# Altium schematic sheet FTDI_Chip.SchDoc
size A; SheetNumber: 2; SheetTotal: 4
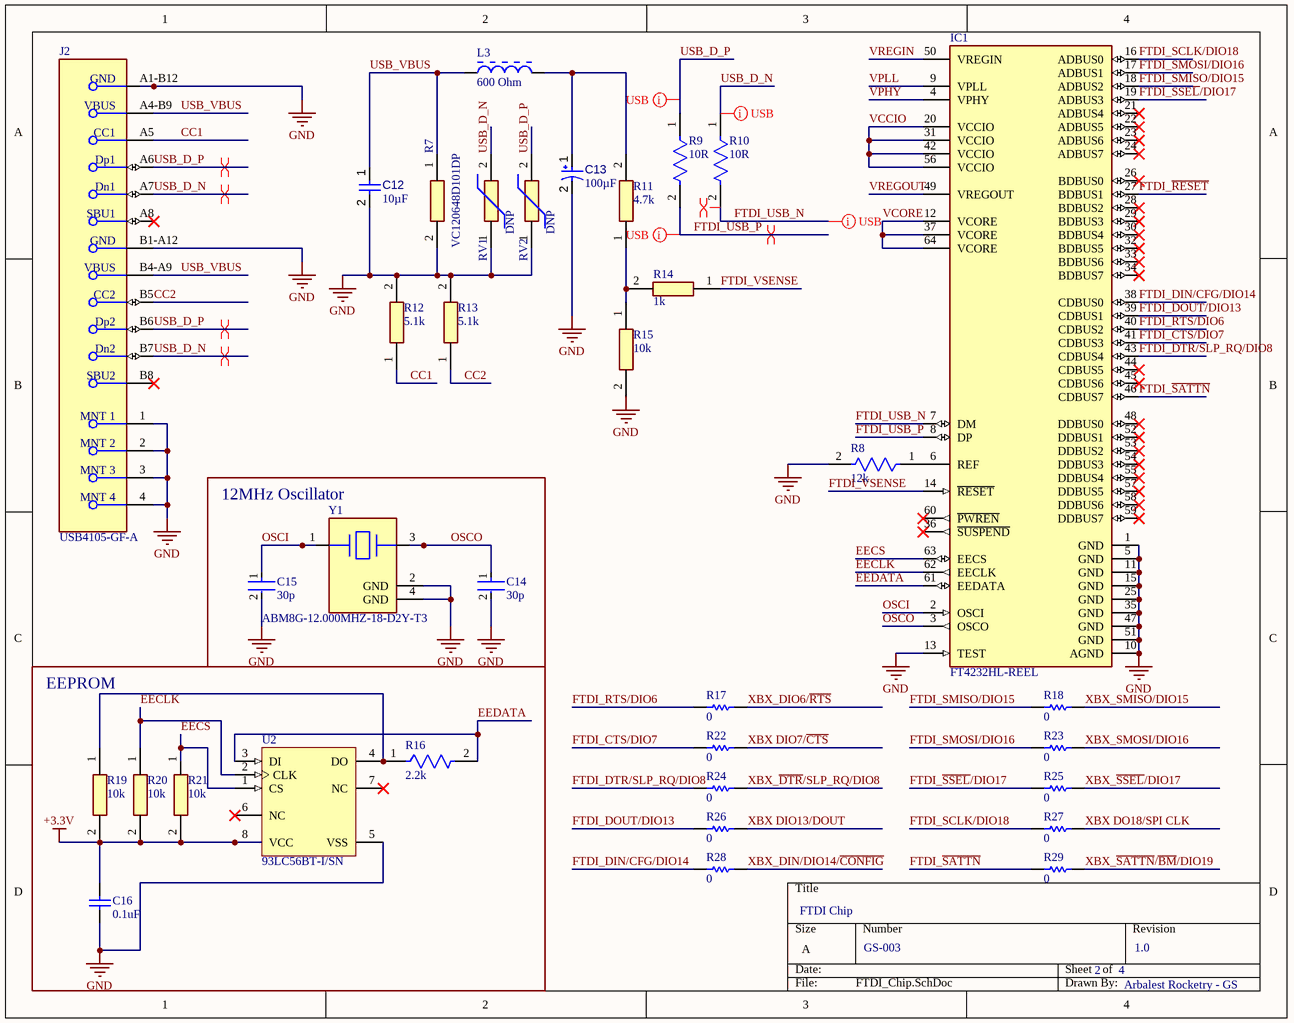
[diagram p0: FTDI_Chip.SchDoc]

## Parts
C12  value 10µF  [CAPC0805(2012)145_L]  (hidden comment: Capacitor 10µF +/-20% 25V 0805)
C13  value 100µF  [CAPPR65-350-1150X800X1250]  (hidden comment: ECA1HM101)
C14  30p  [FP-GCM188-0_1-IPC_B]
C15  30p  [FP-GCM188-0_1-IPC_B]
C16  0.1uF  [CAPC0603(1608)100_L]
IC1  FT4232HL-REEL  [FP-LQFP-64-MFG]
J2  USB4105-GF-A  [FP-USB4105-GF-A-MFG]
L3  600 Ohm  [LIRD-MI0805K601R-10-2_V]
R7  VC120648D101DP  [RESC3216X102N]
R8  12k  [FP-CRCW0402-e3-MFG]
R9  10R  [FP-CRCW0603-e3-MFG]
R10  10R  [FP-CRCW0603-e3-MFG]
R11  4.7k  [RESC1608X55N]
R12  5.1k  [RESC1608X55N]
R13  5.1k  [RESC1608X55N]
R14  1k  [RESC1608X55N]
R15  10k  [RESC1608X55N]
R16  2.2k  [FP-CRCW0603-Pe3-IPC_B]
R17  value 0  [RESC1608X55X25ML10T15]  (hidden comment: Resistor 0R +/- 5% 0603 100 mW)
R18  value 0  [RESC1608X55X25ML10T15]  (hidden comment: Resistor 0R +/- 5% 0603 100 mW)
R19  10k  [RESC1608X55N]
R20  10k  [RESC1608X55N]
R21  10k  [RESC1608X55N]
R22  value 0  [RESC1608X55X25ML10T15]  (hidden comment: Resistor 0R +/- 5% 0603 100 mW)
R23  value 0  [RESC1608X55X25ML10T15]  (hidden comment: Resistor 0R +/- 5% 0603 100 mW)
R24  value 0  [RESC1608X55X25ML10T15]  (hidden comment: Resistor 0R +/- 5% 0603 100 mW)
R25  value 0  [RESC1608X55X25ML10T15]  (hidden comment: Resistor 0R +/- 5% 0603 100 mW)
R26  value 0  [RESC1608X55X25ML10T15]  (hidden comment: Resistor 0R +/- 5% 0603 100 mW)
R27  value 0  [RESC1608X55X25ML10T15]  (hidden comment: Resistor 0R +/- 5% 0603 100 mW)
R28  value 0  [RESC1608X55X25ML10T15]  (hidden comment: Resistor 0R +/- 5% 0603 100 mW)
R29  value 0  [RESC1608X55X25ML10T15]  (hidden comment: Resistor 0R +/- 5% 0603 100 mW)
RV1  DNP  [VARC1608X90N]
RV2  DNP  [VARC1608X90N]
U2  93LC56BT-I/SN  [SOIC-SN8_N]
Y1  ABM8G-12.000MHZ-18-D2Y-T3  [FP-ABM8G-MFG]

## Blocks framed on the sheet
12MHz Oscillator: C14 C15 Y1
EEPROM: C16 R16 R19-R21 U2

## Nets
+3.3V: C16.2 R19.2 R20.2 R21.2 U2.8(VCC)
GND: C12.2 C13.2 C14.2 C15.2 C16.1 IC1.1(GND) IC1.5(GND) IC1.10(AGND) IC1.11(GND) IC1.13(TEST) IC1.15(GND) IC1.25(GND) IC1.35(GND) IC1.47(GND) IC1.51(GND) J2.1(MNT_1) J2.2(MNT_2) J2.3(MNT_3) J2.4(MNT_4) J2.A1-B12(GND) J2.B1-A12(GND) R7.2 R8.2 R12.2 R13.2 R15.2 RV1.1 RV2.1 U2.5(VSS) Y1.2(GND) Y1.4(GND)
CC1: J2.A5(CC1) R12.1
CC2: J2.B5(CC2) R13.1
EECLK: IC1.62(EECLK) R20.1 U2.2(CLK)
EECS: IC1.63(EECS) R21.1 U2.1(CS)
EEDATA: IC1.61(EEDATA) R16.2 U2.3(DI)
FTDI_CTS/DIO7: IC1.41(CDBUS3) R22.1
FTDI_DIN/CFG/DIO14: IC1.38(CDBUS0) R28.1
FTDI_DOUT/DIO13: IC1.39(CDBUS1) R26.1
FTDI_DTR/SLP_RQ/DIO8: IC1.43(CDBUS4) R24.1
FTDI_~{RESET}: IC1.27(BDBUS1)
FTDI_RTS/DIO6: IC1.40(CDBUS2) R17.1
FTDI_~{SATTN}: IC1.46(CDBUS7) R29.1
FTDI_~{SSEL}/DIO17: IC1.19(ADBUS3) R25.1
FTDI_SCLK/DIO18: IC1.16(ADBUS0) R27.1
FTDI_SMISO/DIO15: IC1.18(ADBUS2) R18.1
FTDI_SMOSI/DIO16: IC1.17(ADBUS1) R23.1
FTDI_USB_N: IC1.7(DM) R10.2
FTDI_USB_P: IC1.8(DP) R9.2
FTDI_VSENSE: IC1.14(~{RESET}) R14.1
OSCI: C15.1 IC1.2(OSCI) Y1.1
OSCO: C14.1 IC1.3(OSCO) Y1.3
USB_D_N: J2.A7(Dn1) J2.B7(Dn2) R10.1 RV1.2
USB_D_P: J2.A6(Dp1) J2.B6(Dp2) R9.1 RV2.2
USB_VBUS: C12.1 J2.A4-B9(VBUS) J2.B4-A9(VBUS) L3.1 R7.1
VCCIO: IC1.20(VCCIO) IC1.31(VCCIO) IC1.42(VCCIO) IC1.56(VCCIO)
VCORE: IC1.12(VCORE) IC1.37(VCORE) IC1.64(VCORE)
VPHY: IC1.4(VPHY)
VPLL: IC1.9(VPLL)
VREGIN: IC1.50(VREGIN)
VREGOUT: IC1.49(VREGOUT)
XBX DIO7/~{CTS}: R22.2
XBX DIO13/DOUT: R26.2
XBX DO18/SPI CLK: R27.2
XBX_~{DTR}/SLP_RQ/DIO8: R24.2
XBX_DIN/DIO14/~{CONFIG}: R28.2
XBX_DIO6/~{RTS}: R17.2
XBX_~{SATTN}/~{BM}/DIO19: R29.2
XBX_~{SSEL}/DIO17: R25.2
XBX_SMISO/DIO15: R18.2
XBX_SMOSI/DIO16: R23.2
NetC13_1: C13.1 L3.2 R11.2
NetIC1_6: IC1.6(REF) R8.1
NetR11_1: R11.1 R14.2 R15.1
NetR16_1: R16.1 R19.1 U2.4(DO)

Not connected (* = marked no-connect by the designer): IC1 21(ADBUS4)* 22(ADBUS5)* 23(ADBUS6)* 24(ADBUS7)* 26(BDBUS0)* 28(BDBUS2)* 29(BDBUS3)* 30(BDBUS4)* 32(BDBUS5)* 33(BDBUS6)* 34(BDBUS7)* 36(~{SUSPEND})* 44(CDBUS5)* 45(CDBUS6)* 48(DDBUS0)* 52(DDBUS1)* 53(DDBUS2)* 54(DDBUS3)* 55(DDBUS4)* 57(DDBUS5)* 58(DDBUS6)* 59(DDBUS7)* 60(~{PWREN})*; J2 A8(SBU1)* B8(SBU2)*; U2 6(NC)* 7(NC)*

## Layout directives
differential pair: FTDI_USB_N, FTDI_USB_P, USB_D_N, USB_D_P
net class USB: USB_D_N
mark named USB: FTDI_USB_N, FTDI_USB_P, USB_D_P

## Notes on the sheet
- FTDI Chip
- GS-003
- 2
- 4
- 1.0
- Arbalest Rocketry - GS

## Library data of the parts
C12 = CMP-001-00079-4: Chip Capacitor, 10µF +/-20%, 25V, 0805, Thickness 1.45 mm; Tolerance: 10%; Max Operating Temperature: 85°C; Case/Package: 0805; Voltage Rating: 25V; Min Operating Temperature: -55°C; Mounting Technology: SMT; Pins: 2
C13 = CMP-001-00026-7: Aluminum Electrolytic Capacitor, 100 uF, +/- 20%, 50 V, -40 to 85 degC, 2-Pin THD, RoHS, Bulk; Manufacturer: Panasonic; Voltage Rating: 50V; Ripple Current: 250mA; Datasheet URL: https://industrial.panasonic.com/cdbs/www-data/pdf/RDF0000/ABA0000C1218.pdf; Lead Pitch: 3.5mm; Mounting Technology: TH; Package Description: 2-Pin Radial Lead, Dia 8 mm, Height 12.5 mm; Diameter: 8mm; Ripple Current (AC): 250mA; Manufacturer URL: http://www.panasonic.com/; Capacitor Type: Electrolytic; Max Operating Temperature: 85°C; Pins: 2; Min Operating Temperature: -40°C; Tolerance: 20%; Case/Package: Radial; Packaging: Bulk; Package Quantity: 200; Package Reference: CAPPR65-350-1150X800X1250; RoHS Compliant: True; Datasheet Version: Rev. 05, 10/2016
C14 C15 = CMP-06035-014609-1: Ceramic Capacitor for Automotive 30pF  ±1% 100VDC C0G 0603 Paper T/R
C16 = CMP-1035-02591-1: CAP 100nF 50V ±5% 0603 (1608 Metric) Thickness 1mm SMD; Tolerance: Â±5%; Case-Metric: 1608; Case-EIA: 0603; Rated Voltage: 50 V; Max Thickness: 1 mm; Technology: SMT; Value: 100nF
IC1 = CMP-0078-00021-4: IC USB HS QUAD UART/SYNC 64-LQFP; Manufacturer: FTDI; Number Of Ports: 1; Max Supply Voltage: 3.6V; Data Rate: 480Mbits/s; Nominal Supply Current: 70mA; Usb Standard: USB 2.0; Interface: I2C,SPI,UART,USB,Other; Min Supply Voltage: 3V; Standoff Height: 0.05mm; Ipc Land Pattern Name: QFP50P1200X1200X160-64; ComponentLink2Description: Datasheet; Temperature Range Low: -40°C; Footprint Url: https://www.ftdichip.com/Support/Documents/TechnicalNotes/TN_166%20FTDI%20Example%20IC%20PCB%20Footprints.pdf; Manufacturer Part Number: FT4232HL-REEL; Height: 1.6mm; ComponentLink2URL: https://www.ftdichip.com/Support/Documents/DataSheets/ICs/DS_FT4232H.pdf; Device Class L2: Interface ICs; Ambient Temperature Range Low: -40°C; RoHS: TRUE; Package: LQFP-64; Temperature Range High: +85°C; Digikey Description: IC USB HS QUAD UART/SYNC 64-LQFP; Temperature: -40°C to +85°C; Lead Free: Yes; Device Class L1: Integrated Circuits (ICs); Category: IC; Automotive: No; Ambient Temperature Range High: +85°C; Octopart: https://octopart.com/ft4232hl-reel-ftdi-19172127; Device Class L3: USB Interface ICs
J2 = CMP-245163-000001-1: CONN RCPT USB2.0 TYPEC 5A; Manufacturer: GCT; Voltage Rating: 20V; Is Female: yes; Current Rating: 5/6.25/1.25/0.25A; Number Of Contacts: 16; Conn Orientation: Right Angle; Device Class L1: Connectors; Category: Conn; Lead Free: Yes; RoHS: TRUE; Temperature Range High: +85°C; Digikey Description: CONN RCPT USB2.0 TYPEC 5A; Device Class L3: unset; ComponentLink2Description: Datasheet; Manufacturer Part Number: USB4105-GF-A; Package: 0; Usb Standard: USB 2.0; Device Class L2: USB Connectors; Automotive: No; Temperature Range Low: -40°C; Height: 3.46mm; Temperature: -40°C to +85°C; Contact Material: Gold,Nickel; ComponentLink2URL: https://gct.co/files/drawings/usb4105.pdf; Octopart: https://octopart.com/usb4105-gf-a-gct-106627878
L3 = CMP-2000-05196-1: Chip Bead for Power Filtering, 1500 mA, 600 Ohm, -40 to 125 degC, 0805 (2012 Metric), RoHS, Tape and Reel; Manufacturer: Laird; Filter Type: PowerLine; Current Rating (Max): 1.5A; Catalog Drawings: (HI,HZ,LI,MI)0805Series_1.10mmMax.Height; Impedance @ Frequency: 600Ohm@100MHz; Number of Lines: 1; DC Resistance (DCR) (Max): 100mOhm; Other Names: 240-2390-1; Kits: 240-2227-ND-KITEMIFERRITEBEADCHIPSMD; Online Catalog: MISeries; Standard Package: 1; Datasheet Version: Rev. A, 01/2004; Height (Max): 0.043"(1.10mm); Category: Filters; Operating Temperature: -40degC~125degC; Package Description: 2-Pin Surface Mount Device, Body 2 x 1.25 mm; Package / Case: 0805(2012Metric); Package Reference: MI0805K601R-10-2; Packaging: CutTape(CT); Ratings: -; Mounting Type: SurfaceMount; Datasheet URL: https://datasheet.ciiva.com/3082/mi0805k601r-10-a-vp-3082219.pdf; Size / Dimension: 0.079"Lx0.049"W(2.00mmx1.25mm); Family: FerriteBeadsandChips; Manufacturer URL: https://www.lairdtech.com; Series: MI
R7 = VC120648D101DP: Varistor; Manufacturer_Name: Kyocera AVX; Datasheet Link: https://componentsearchengine.com/Datasheets/2/VC120648D101DP.pdf; Height: 1.02mm; Manufacturer_Part_Number: VC120648D101DP; Mouser Part Number: 581-VC120648D101DP; Mouser Price/Stock: https://www.mouser.com/Search/Refine.aspx?Keyword=581-VC120648D101DP; Arrow Part Number: VC120648D101DP; Arrow Price/Stock: https://www.arrow.com/en/products/vc120648d101dp/avx?region=europe
R8 = CMP-02407-010136-1: RES Thick Film, 12kΩ, 1%, 0.063W, 100ppm/°C, 0402; Max Power Dissipation: 63mW; Resistance: 12kR; Max Operating Temperature: 155°C; Temperature Coefficient: 100ppm/°C; Composition: Thick Film; Packaging: Tape and Reel; Min Operating Temperature: -55°C; Length: 0.039inch; Height: 0.016inch; Number of Terminations: 2; Features: Automotive AEC-Q200; Lead Free: Lead Free; Package Quantity: 50000; Case/Package: 0402; Tolerance: 1%; Width: 0.02inch
R9 R10 = CMP-02407-006896-1: RES Thick Film, 10Ω, 1%, 0.1W, 100ppm/°C, 0603; Power Rating: 100mW; Lead Free: Lead Free; Case/Package: 0603; Tolerance: 1%; Resistance: 10R
R11 = CR0603-JW-472ELF: Resistor; Manufacturer_Name: Bourns; Datasheet Link: https://www.bourns.com/pdfs/chpreztr.pdf; Height: 0.55mm; Manufacturer_Part_Number: CR0603-JW-472ELF; Mouser Part Number: 652-CR0603-JW-472ELF; Mouser Price/Stock: https://www.mouser.co.uk/ProductDetail/Bourns/CR0603-JW-472ELF?qs=YYkh393lUtir45oxsbM4ug%3D%3D; Arrow Part Number: CR0603-JW-472ELF; Arrow Price/Stock: https://www.arrow.com/en/products/cr0603-jw-472elf/bourns?region=nac
R12 R13 = CR0603-FX-5101ELF: Resistor; Manufacturer_Name: Bourns; Datasheet Link: https://www.bourns.com/pdfs/chpreztr.pdf; Height: 0.55mm; Manufacturer_Part_Number: CR0603-FX-5101ELF; Mouser Part Number: 652-CR0603FX-5101ELF; Mouser Price/Stock: https://www.mouser.co.uk/ProductDetail/Bourns/CR0603-FX-5101ELF?qs=0nF2VnfAjXkzZl7D0jRjmQ%3D%3D; Arrow Part Number: CR0603-FX-5101ELF; Arrow Price/Stock: https://www.arrow.com/en/products/cr0603-fx-5101elf/bourns?utm_currency=USD&region=nac
R14 = CR0603-JW-102ELF: Resistor; Manufacturer_Name: Bourns; Datasheet Link: https://www.bourns.com/pdfs/chpreztr.pdf; Height: 0.55mm; Manufacturer_Part_Number: CR0603-JW-102ELF; Mouser Part Number: 652-CR0603-JW-102ELF; Mouser Price/Stock: https://www.mouser.co.uk/ProductDetail/Bourns/CR0603-JW-102ELF?qs=rcPhh2wube3o3zlmFZCUPg%3D%3D; Arrow Part Number: CR0603-JW-102ELF; Arrow Price/Stock: https://www.arrow.com/en/products/cr0603-jw-102elf/bourns?region=nac
R15 R19-R21 = CR0603-FX-1002ELF: Resistor; Manufacturer_Name: Bourns; Datasheet Link: https://www.bourns.com/pdfs/chpreztr.pdf; Height: 0.55mm; Manufacturer_Part_Number: CR0603-FX-1002ELF; Mouser Part Number: 652-CR0603FX-1002ELF; Mouser Price/Stock: https://www.mouser.co.uk/ProductDetail/Bourns/CR0603-FX-1002ELF?qs=K5ddiUFZPT6XHG0dQH96QA%3D%3D; Arrow Part Number: CR0603-FX-1002ELF; Arrow Price/Stock: https://www.arrow.com/en/products/cr0603-fx-1002elf/bourns?utm_currency=USD&region=europe
R16 = CMP-03613-000087-1: RES Thick Film, 2.2kΩ, 1%, 0.1W, 50ppm/°C, 0603; Resistance: 2.2kR; Max Power Dissipation: 100mW; Package Quantity: 5000; Military Standard: Not; Min Operating Temperature: -55°C; Tolerance: 1%; Number of Terminations: 2; Features: Automotive AEC-Q200; Temperature Coefficient: 50ppm/°C; Max Operating Temperature: 155°C; RoHS Compliant: Yes; Height: 0.02inch; Case/Package: 0603; Width: 0.033inch; Series: CRCW-P; Depth: 0.85mm; Resistor Type: Thick Film; Length: 0.061inch; Packaging: Tape and Reel
R17 R18 R22-R29 = CMP-009-00006-5: Chip Resistor, 0 Ohm, 0.1 W, -55 to 155 degC, 0603 (1608 Metric); Power: 100mW; Voltage Rating: 50V; Max Operating Temperature: 155°C; RoHS Compliant: True; Mounting Technology: SM; Case/Package: 0603; Min Operating Temperature: -55°C; Tolerance: 5%; Pins: 2
RV1 RV2 = USB0001DP: Varistor; Manufacturer_Name: Kyocera AVX; Datasheet Link: https://mouser.componentsearchengine.com/Datasheets/1/USB0001DP.pdf; Height: 0.9mm; Manufacturer_Part_Number: USB0001DP; Mouser Part Number: 581-USB0001DP; Mouser Price/Stock: https://www.mouser.co.uk/ProductDetail/KYOCERA-AVX/USB0001DP?qs=uJhfjP5Xp6wpAsZ0ctZLuw%3D%3D; Arrow Part Number: USB0001DP; Arrow Price/Stock: https://www.arrow.com/en/products/usb0001dp/avx?utm_currency=USD&region=nac
U2 = CMP-0162-00090-1: 2K, 128x16-bit, 2.5V Microwire Serial EEPROM, 8-Pin SOIC 150mil, Industrial Temperature, Tape and Reel; PackageDescription: 8-Lead Plastic Small Outline (SN) - Narrow, 3.90mm Body [SOIC]; DatasheetVersion: revF, May-2008; Code_IPC: SOIC127P600-8; Code_JEDEC: MS-012; PackageVersion: revBB, Aug-2009; PackageReference: SOIC-SN8
Y1 = CMP-27762-015318-1: Crystal 12MHz ±20ppm (Tol) ±30ppm (Stability) 18pF FUND 120Ω 4-Pin SMD T/R; Series Resistance: 120R; Load Capacitance: 18pF; Mount: Surface Mount; Length: 0.126inch; Package Quantity: 3000; Termination: SMD/SMT; Width: 2.5mm; Max Operating Temperature: 85°C; ESR (Equivalent Series Resistance): 120R; Packaging: Tape and Reel; Operating Frequency: 12 MHz; Frequency Tolerance: 20ppm; Frequency: 12MHz; Lead Free: Lead Free; Case/Package: SMD/SMT; Height: 0.039inch; Tolerance: 20ppm; Series: ABM8G; Frequency Stability: 30ppm; Min Operating Temperature: -40°C; Number of Pins: 4